# EAGLE design hvsp2 (EAGLE 6.5.0)
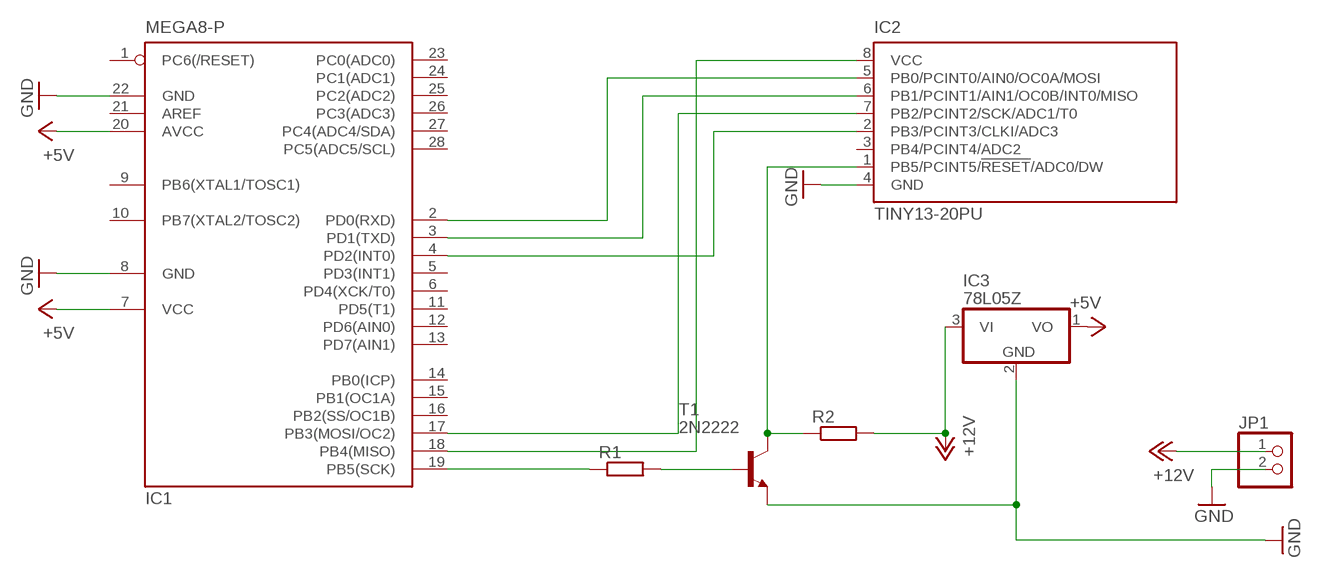
[diagram p0: schematic, sheet 1]

## Parts
IC1  MEGA8-P  [DIL28-3]
IC2  TINY13-20PU  [DIL08]
IC3  78L05Z  [TO92]
JP1  PINHD-1X2  [1X02]
R1  R-EU_0204/7  [0204/7]
R2  R-EU_0207/10  [0207/10]
T1  2N2222  [TO18]

## Nets
+5V: IC1.7(VCC) IC1.20(AVCC) IC3.1(VO)
+12V: IC3.3(VI) JP1.1 R2.2
GND: IC1.8(GND) IC1.22(GND) IC2.4(GND) IC3.2(GND) JP1.2 T1.1(E)
N$1: IC2.1(PB5/PCINT5/!RESET!/ADC0/DW) R2.1 T1.3(C)
N$2: IC1.18(PB4(MISO)) IC2.8(VCC)
N$3: R1.2 T1.2(B)
N$4: IC1.19(PB5(SCK)) R1.1
N$5: IC1.17(PB3(MOSI/OC2)) IC2.7(PB2/PCINT2/SCK/ADC1/T0)
N$6: IC1.2(PD0(RXD)) IC2.5(PB0/PCINT0/AIN0/OC0A/MOSI)
N$7: IC1.3(PD1(TXD)) IC2.6(PB1/PCINT1/AIN1/OC0B/INT0/MISO)
N$8: IC1.4(PD2(INT0)) IC2.2(PB3/PCINT3/CLKI/ADC3)
Unconnected: IC1.1(PC6(/RESET)) IC1.5(PD3(INT1)) IC1.6(PD4(XCK/T0)) IC1.9(PB6(XTAL1/TOSC1)) IC1.10(PB7(XTAL2/TOSC2)) IC1.11(PD5(T1)) IC1.12(PD6(AIN0)) IC1.13(PD7(AIN1)) IC1.14(PB0(ICP)) IC1.15(PB1(OC1A)) IC1.16(PB2(SS/OC1B)) IC1.21(AREF) IC1.23(PC0(ADC0)) IC1.24(PC1(ADC1)) IC1.25(PC2(ADC2)) IC1.26(PC3(ADC3)) IC1.27(PC4(ADC4/SDA)) IC1.28(PC5(ADC5/SCL)) IC2.3(PB4/PCINT4/ADC2)

## Library data of the parts
IC1 = atmel:MEGA8-P: MICROCONTROLLER 8 Kbytes FLASH, 1 kbytes SRAM, 512 bytes EEPROM, USART, 4-channel 10 bit ADC, 2-channel 8 bit ADC Pin compatible with Atmega48, ATMega88, ATMega168 Source: avr.lbr; OC_FARNELL: unknown; OC_NEWARK: unknown
IC2 = atmel:TINY13: 8-bit AVR Microcontroller with 1K Bytes In-System Programmable Flash Source: http://www.atmel.com/dyn/resources/prod_documents/2535S.pdf; MPN: ATTINY13-20PU; OC_FARNELL: 9171550; OC_NEWARK: 96K6521
IC3 = linear:78*: Positive VOLTAGE REGULATOR Source: http://cache.national.com/ds/LM/LM78L05.pdf http://www.fairchildsemi.com/ds/LM/LM7805.pdf
JP1 = pinhead:PINHD-1X2: PIN HEADER
R1 = rcl:R-EU_: RESISTOR, European symbol
R2 = resistor:R-EU_: RESISTOR, European symbol
T1 = transistor:2N2222: NPN TRANSISTOR

## Board
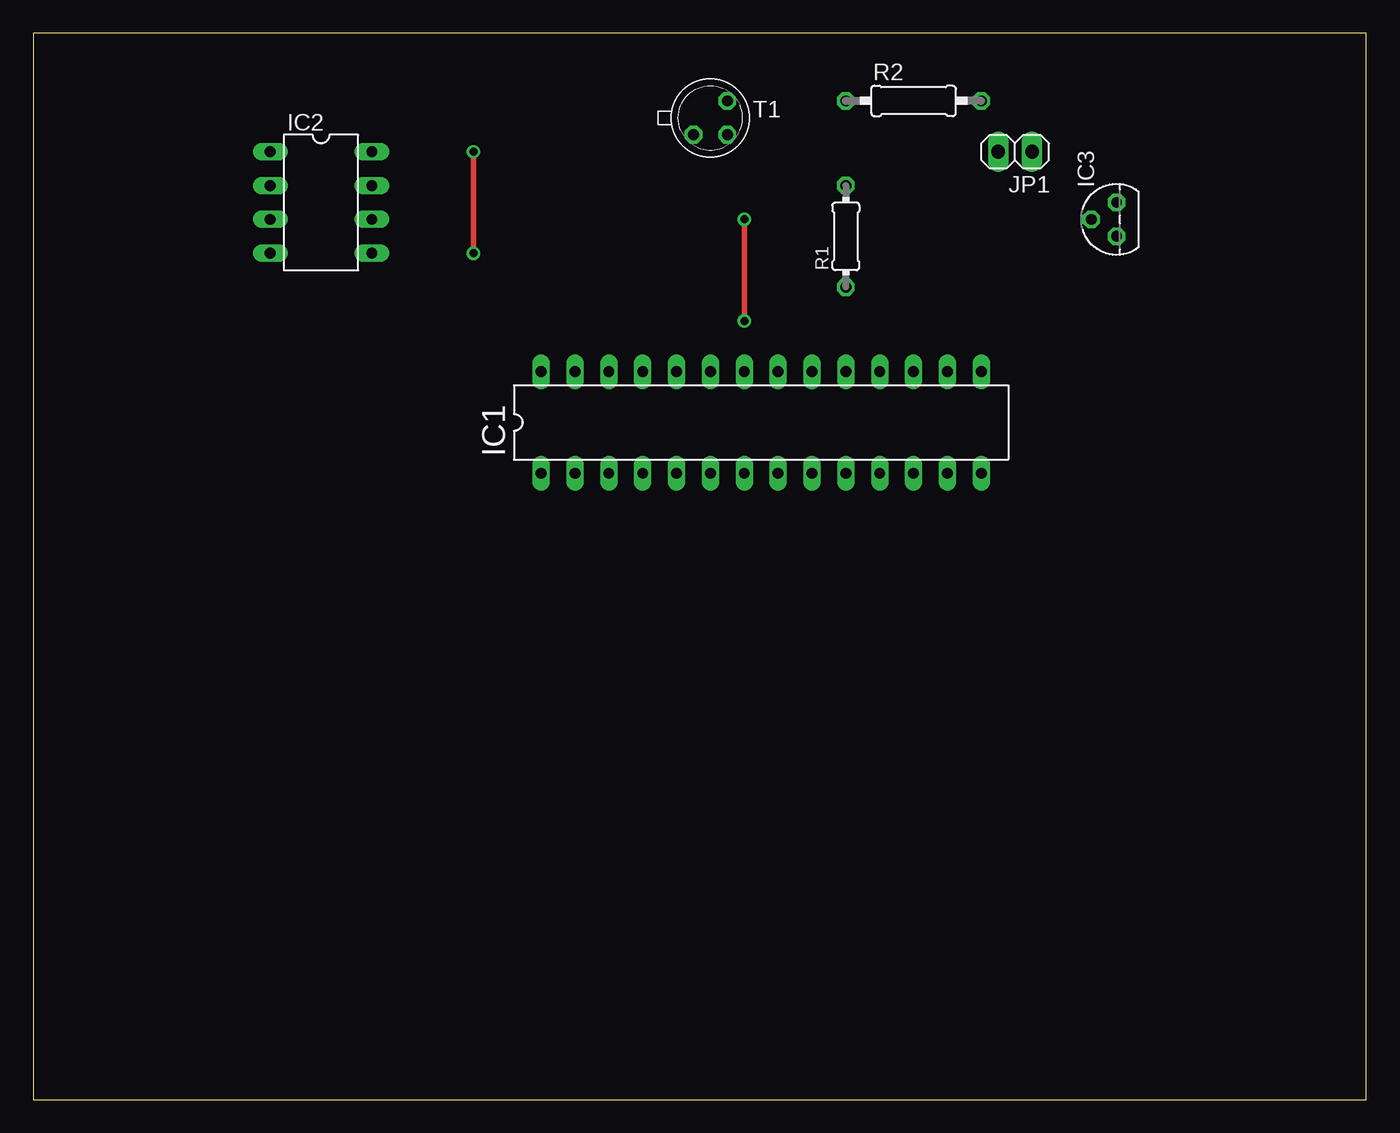
[diagram p1: board, top side]
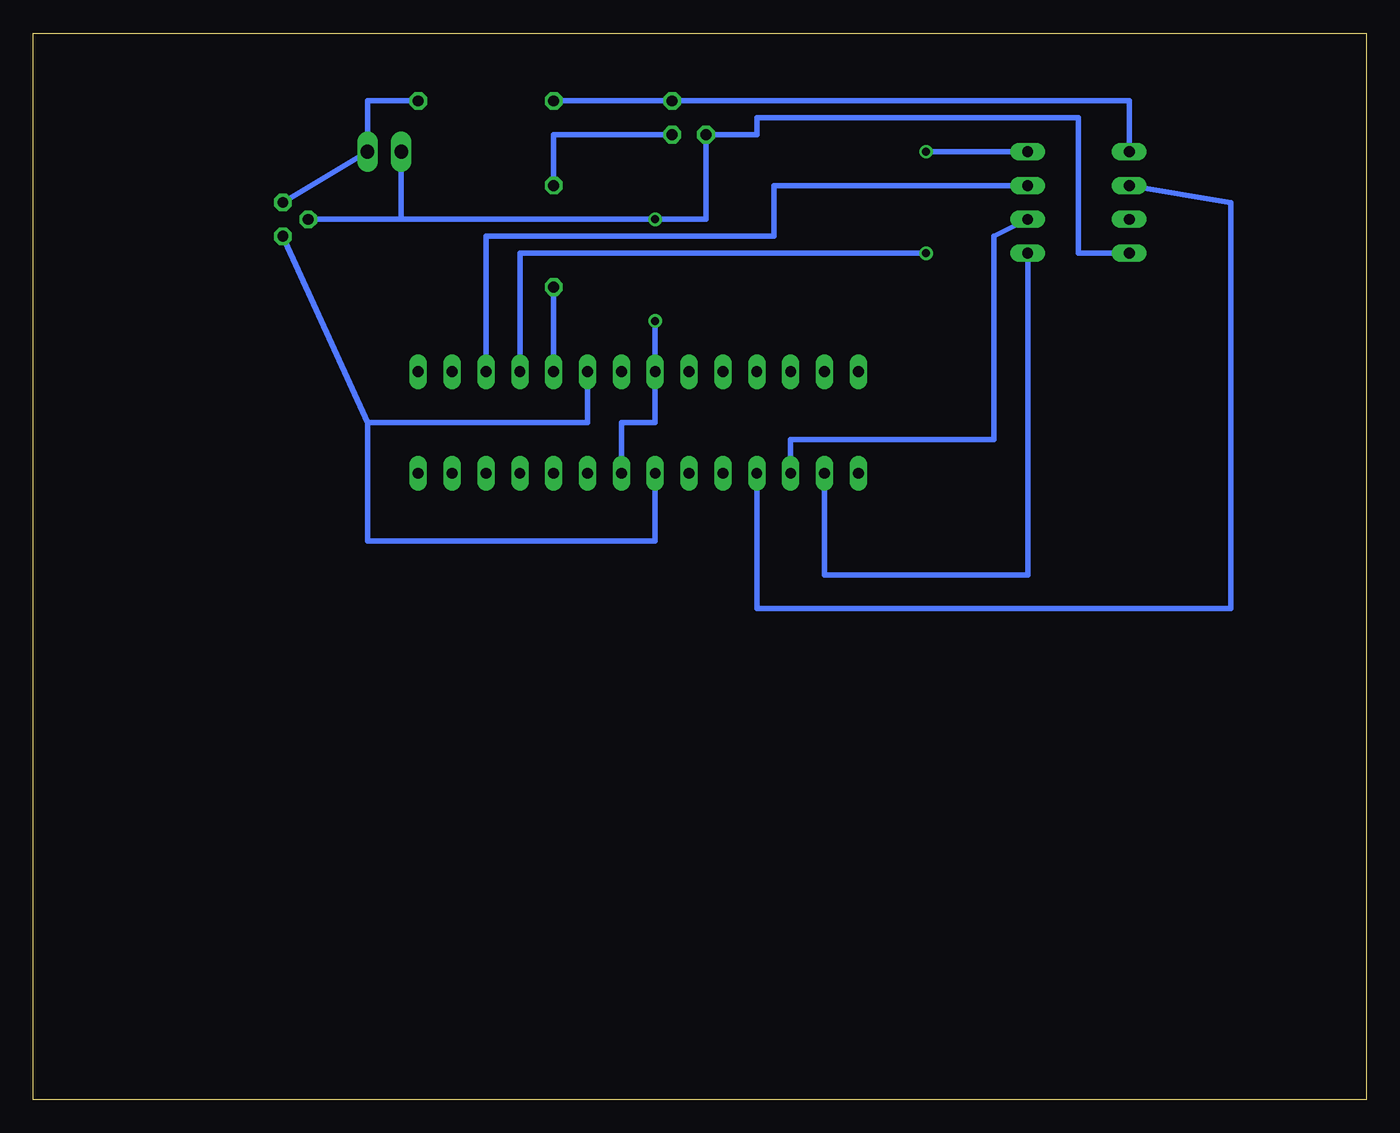
[diagram p2: board, bottom side, seen from below]

Size 100 x 80 mm. Coordinates in mm from the lower left corner, seen from the top.
Outline: 0,0 100,0 100,80 0,80 0,0
Copper layers (1*16): Top 0.035mm / dielectric 1.5mm / Bottom 0.035mm
Design rules "default": minimum track width 10mil, minimum drill 24mil, track to track 8mil, track to pad 8mil, pad to pad 8mil, via to via 8mil, smd to smd 8mil, copper to edge 40mil, drill to drill 8mil, minimum pad ring 10mil, minimum via ring 8mil, stop-mask expansion 4mil, vias tented up to drill 0mil, thermal gap 10mil

### Footprints (pad centres in the part's own frame; a part is rotated, then mirrored left to right if it is on the bottom)
DIL28-3 = drill 0.813 long: 1 -16.51,-3.81; 2 -13.97,-3.81; 3 -11.43,-3.81; 4 -8.89,-3.81; 5 -6.35,-3.81; 6 -3.81,-3.81; 7 -1.27,-3.81; 8 1.27,-3.81; 9 3.81,-3.81; 10 6.35,-3.81; 11 8.89,-3.81; 12 11.43,-3.81; 13 13.97,-3.81; 14 16.51,-3.81; 15 16.51,3.81; 16 13.97,3.81; 17 11.43,3.81; 18 8.89,3.81; 19 6.35,3.81; 20 3.81,3.81; 21 1.27,3.81; 22 -1.27,3.81; 23 -3.81,3.81; 24 -6.35,3.81; 25 -8.89,3.81; 26 -11.43,3.81; 27 -13.97,3.81; 28 -16.51,3.81
DIL08 = drill 0.813 long: 1 -3.81,-3.81; 2 -1.27,-3.81; 3 1.27,-3.81; 4 3.81,-3.81; 5 3.81,3.81; 6 1.27,3.81; 7 -1.27,3.81; 8 -3.81,3.81
TO92 = drill 0.813 octagon: 1 -1.27,0; 2 0,1.905; 3 1.27,0
1X02 = drill 1.016 long: 1 -1.27,0; 2 1.27,0
0204/7 = drill 0.813 octagon: 1 -3.81,0; 2 3.81,0
0207/10 = drill 0.813 octagon: 1 -5.08,0; 2 5.08,0
TO18 = drill 0.813 octagon: 1 -1.27,-1.27; 2 1.27,-1.27; 3 1.27,1.27

### Placement (x,y rotation side)
IC1  54.61,50.8 0 top
IC2  21.59,67.31 270 top
IC3  81.28,66.04 90 top
JP1  73.66,71.12 180 top
R1  60.96,64.77 90 top
R2  66.04,74.93 0 top
T1  50.8,73.66 0 top

### Tracks (layer width: path | path; a pad name or v marks a point on that pad's centre or on a via)
+5V
  Bottom 0.406: IC3.1 74.93,50.8 | 74.93,50.8 74.93,41.91 53.34,41.91 IC1.7 | IC1.20 58.42,50.8 74.93,50.8
+12V
  Bottom 0.406: IC3.3 JP1.1 74.93,74.93 R2.2
GND  (via drill 0.6)
  Top 0.406: v53.34,66.04 v53.34,58.42
  Bottom 0.406: IC1.8 55.88,50.8 53.34,50.8 IC1.22 v53.34,58.42 | JP1.2 72.39,66.04 | 72.39,66.04 IC3.2 | 72.39,66.04 v53.34,66.04 49.53,66.04 T1.1 45.72,72.39 45.72,73.66 21.59,73.66 21.59,63.5 IC2.4
N$1
  Bottom 0.406: R2.1 T1.3 17.78,74.93 IC2.1
N$2  (via drill 0.6)
  Top 0.406: v33.02,63.5 v33.02,71.12
  Bottom 0.406: IC1.18 63.5,63.5 v33.02,63.5 | IC2.8 v33.02,71.12
N$3
  Bottom 0.406: T1.2 60.96,72.39 R1.2
N$4
  Bottom 0.406: R1.1 IC1.19
N$5
  Bottom 0.406: IC1.17 66.04,64.77 44.45,64.77 44.45,68.58 IC2.7
N$6
  Bottom 0.406: IC1.2 40.64,39.37 25.4,39.37 IC2.5
N$7
  Bottom 0.406: IC1.3 43.18,49.53 27.94,49.53 27.94,64.77 IC2.6
N$8
  Bottom 0.406: IC1.4 45.72,36.83 10.16,36.83 10.16,67.31 IC2.2